# Altium schematic sheet 01_DEBUG.SchDoc
size A3; SheetNumber: 2; SheetTotal: 2
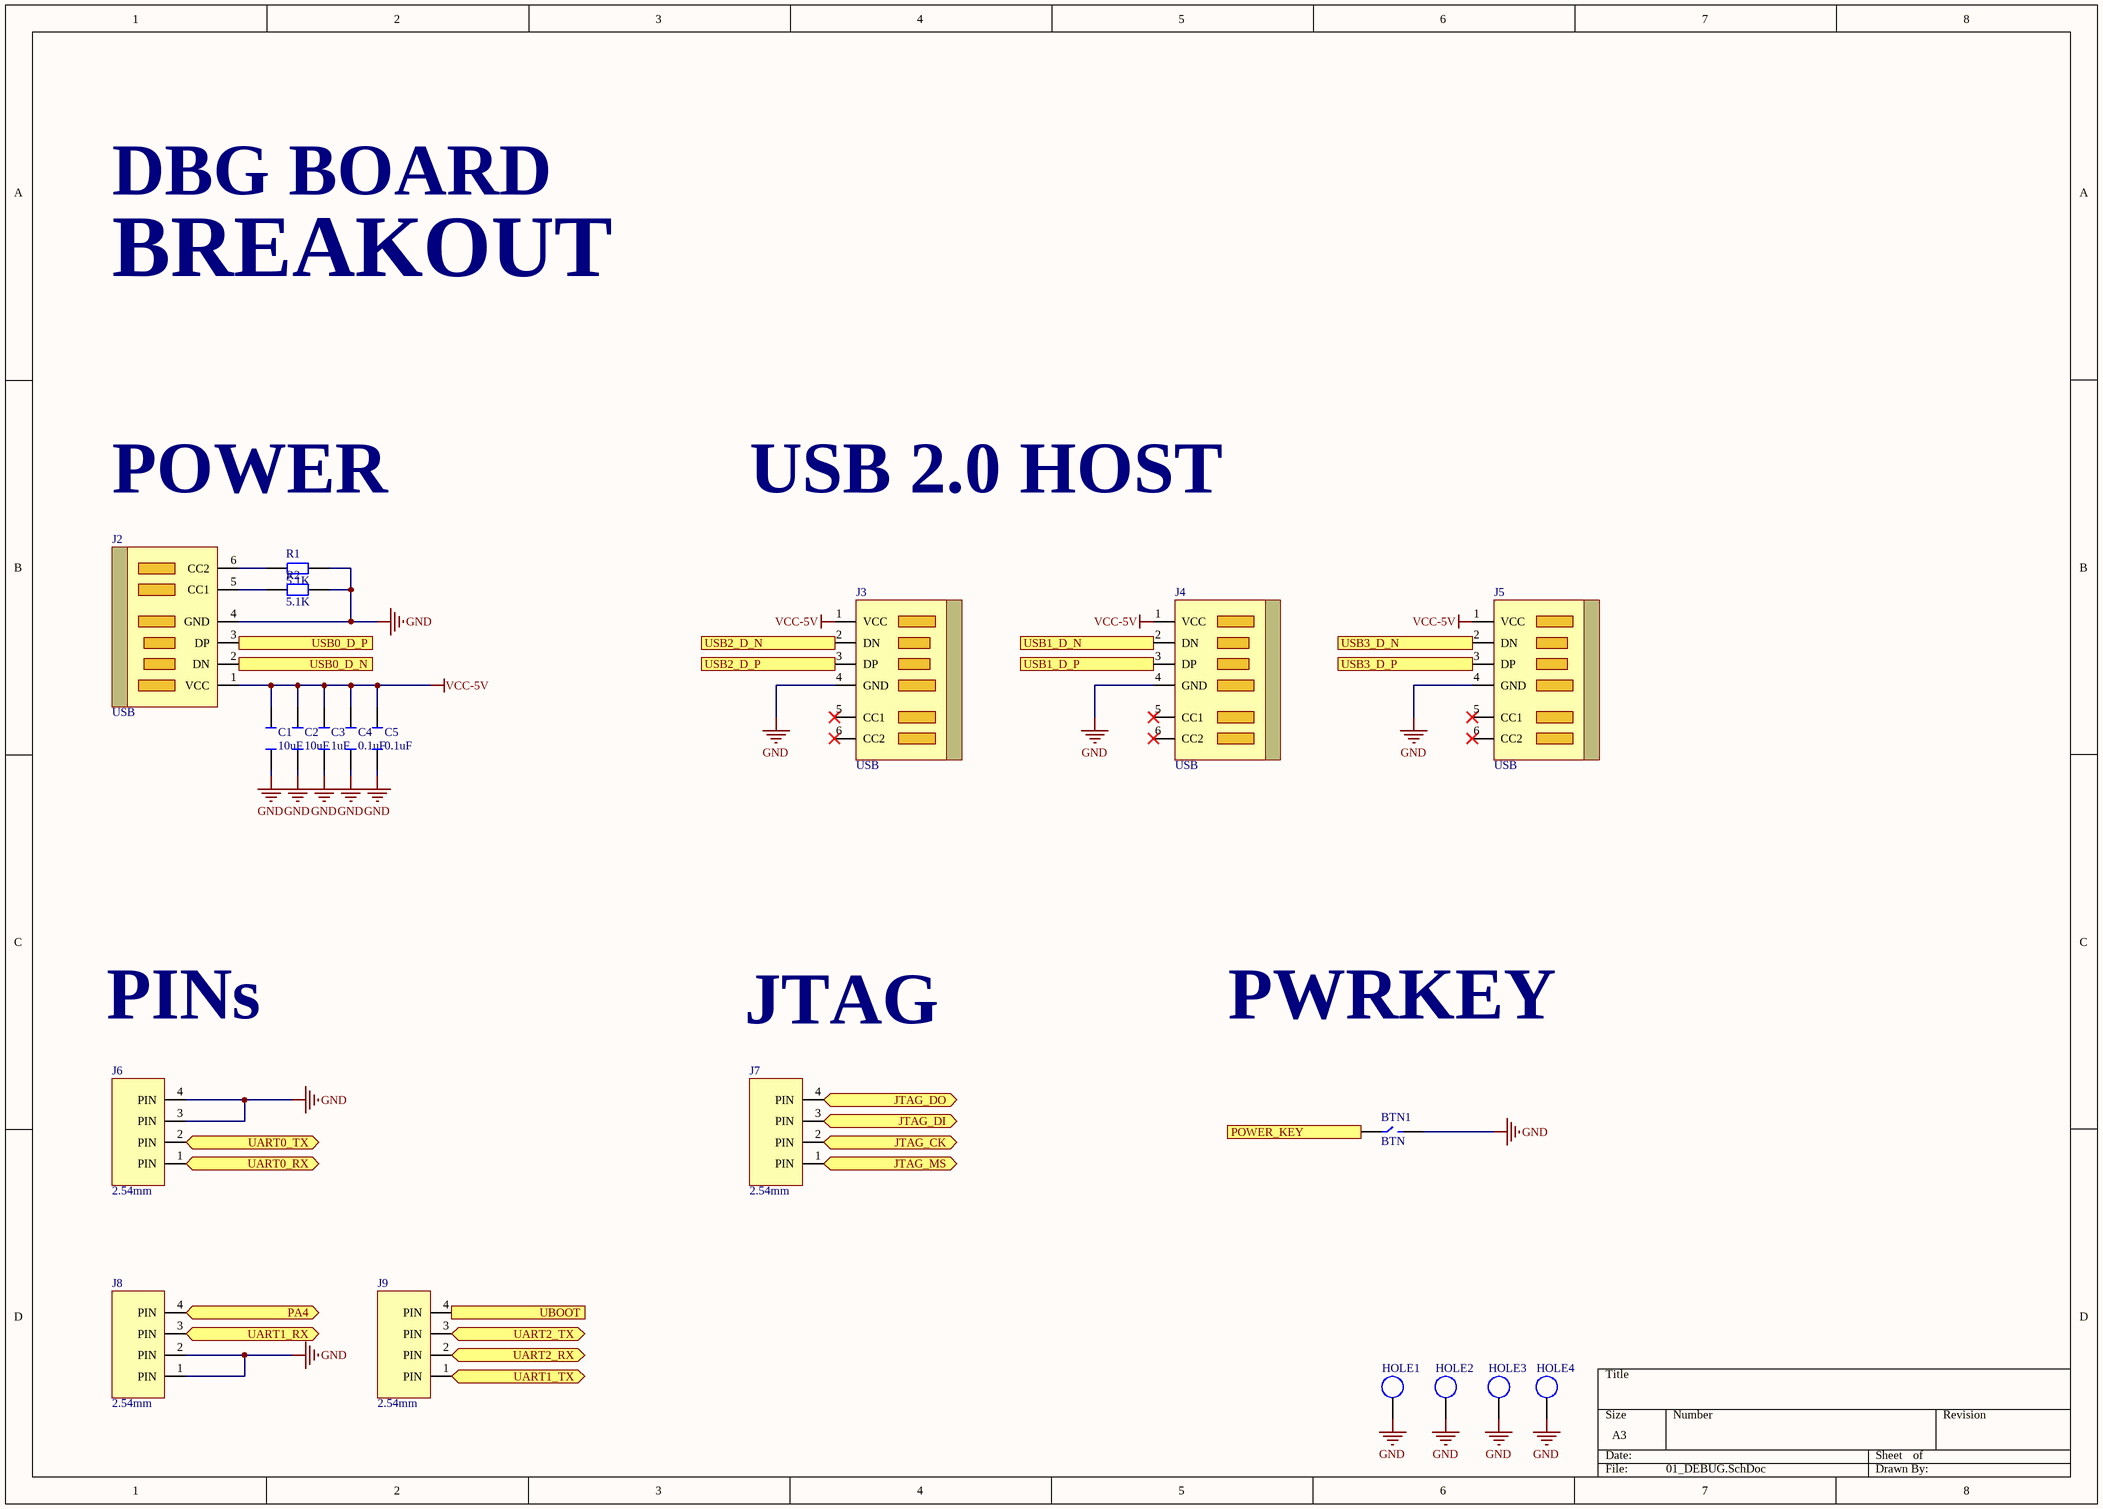
[diagram p0: 01_DEBUG.SchDoc]

## Parts
BTN1  BTN  [BTN]
C1  10uF  [C0603]
C2  10uF  [C0603]
C3  1uF  [C0603]
C4  0.1uF  [C0603]
C5  0.1uF  [C0603]
HOLE1  LOADHOLE  [LOADHOLE]  (value not drawn)
HOLE2  LOADHOLE  [LOADHOLE]  (value not drawn)
HOLE3  LOADHOLE  [LOADHOLE]  (value not drawn)
HOLE4  LOADHOLE  [LOADHOLE]  (value not drawn)
J2  USB  [USB-4105-GF-A]
J3  USB  [USB-A-S-S-W-TH]
J4  USB  [USB-A-S-S-W-TH]
J5  USB  [USB-A-S-S-W-TH]
J6  2.54mm  [J_PIN4]
J7  2.54mm  [J_PIN4]
J8  2.54mm  [J_PIN4]
J9  2.54mm  [J_PIN4]
R1  5.1K  [R0603]
R2  5.1K  [R0603]

## Ports
JTAG_CK (bidir), JTAG_DI (bidir), JTAG_DO (bidir), JTAG_MS (bidir), PA4 (bidir), POWER_KEY (in), UART0_RX (bidir), UART0_TX (bidir), UART1_RX (bidir), UART1_TX (bidir), UART2_RX (bidir), UART2_TX (bidir), UBOOT (out), USB0_D_N (in), USB0_D_P (in), USB1_D_N (in), USB1_D_P (in), USB2_D_N (in), USB2_D_P (in), USB3_D_N (in), USB3_D_P (in)

## Nets
GND: BTN1.2 C1.1 C2.1 C3.1 C4.1 C5.1 HOLE1.1 HOLE2.1 HOLE3.1 HOLE4.1 J2.4(GND) J3.4(GND) J4.4(GND) J5.4(GND) J6.3(PIN) J6.4(PIN) J8.1(PIN) J8.2(PIN) R1.2 R2.2
VCC-5V: C1.2 C2.2 C3.2 C4.2 C5.2 J2.1(VCC) J3.1(VCC) J4.1(VCC) J5.1(VCC)
JTAG_CK: J7.2(PIN) ; port JTAG_CK
JTAG_DI: J7.3(PIN) ; port JTAG_DI
JTAG_DO: J7.4(PIN) ; port JTAG_DO
JTAG_MS: J7.1(PIN) ; port JTAG_MS
PA4: J8.4(PIN) ; port PA4
POWER_KEY: BTN1.1 ; port POWER_KEY
UART0_RX: J6.1(PIN) ; port UART0_RX
UART0_TX: J6.2(PIN) ; port UART0_TX
UART1_RX: J8.3(PIN) ; port UART1_RX
UART1_TX: J9.1(PIN) ; port UART1_TX
UART2_RX: J9.2(PIN) ; port UART2_RX
UART2_TX: J9.3(PIN) ; port UART2_TX
UBOOT: J9.4(PIN) ; port UBOOT
USB0_D_N: J2.2(DN) ; port USB0_D_N
USB0_D_P: J2.3(DP) ; port USB0_D_P
USB1_D_N: J4.2(DN) ; port USB1_D_N
USB1_D_P: J4.3(DP) ; port USB1_D_P
USB2_D_N: J3.2(DN) ; port USB2_D_N
USB2_D_P: J3.3(DP) ; port USB2_D_P
USB3_D_N: J5.2(DN) ; port USB3_D_N
USB3_D_P: J5.3(DP) ; port USB3_D_P
NetJ2_5: J2.5(CC1) R2.1
NetJ2_6: J2.6(CC2) R1.1

Not connected (* = marked no-connect by the designer): J3 5(CC1)* 6(CC2)*; J4 5(CC1)* 6(CC2)*; J5 5(CC1)* 6(CC2)*

## Notes on the sheet
- DBG BOARD
- BREAKOUT
- POWER
- USB 2.0 HOST
- PINs
- JTAG
- PWRKEY

## Library data of the parts
C1 C2 = C_10UF
C3 = C_1UF
C4 C5 = C_0.1UF
J6-J9 = J_PIN4
R1 R2 = R_5.1K